# EasyEDA schematic 2_3_4.json
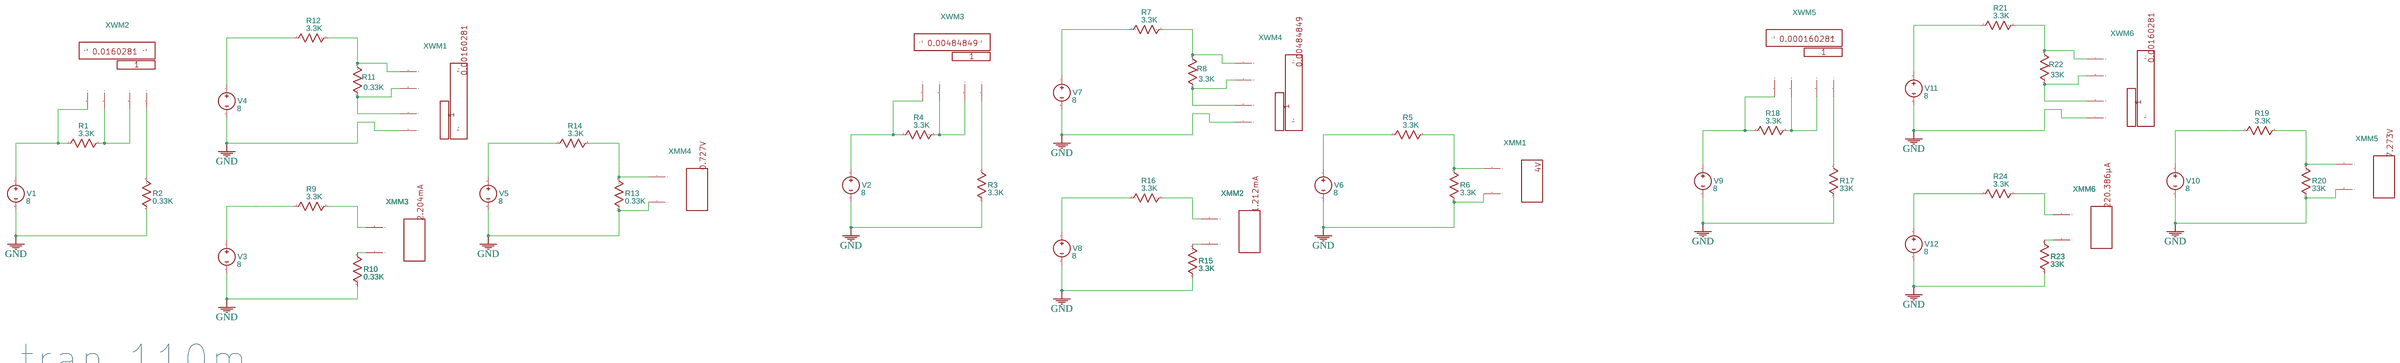
[diagram p0: schematic sheet]

## Parts
R1  3.3K  [AXIAL-0.3]
R2  0.33K  [AXIAL-0.3]
R3  3.3K  [AXIAL-0.3]
R4  3.3K  [AXIAL-0.3]
R5  3.3K  [AXIAL-0.3]
R6  3.3K  [AXIAL-0.3]
R7  3.3K  [AXIAL-0.3]
R8  3.3K  [AXIAL-0.3]
R9  3.3K  [AXIAL-0.3]
R10  0.33K  [AXIAL-0.3]
R11  0.33K  [AXIAL-0.3]
R12  3.3K  [AXIAL-0.3]
R13  0.33K  [AXIAL-0.3]
R14  3.3K  [AXIAL-0.3]
R15  3.3K  [AXIAL-0.3]
R16  3.3K  [AXIAL-0.3]
R17  33K  [AXIAL-0.3]
R18  3.3K  [AXIAL-0.3]
R19  3.3K  [AXIAL-0.3]
R20  33K  [AXIAL-0.3]
R21  3.3K  [AXIAL-0.3]
R22  33K  [AXIAL-0.3]
R23  33K  [AXIAL-0.3]
R24  3.3K  [AXIAL-0.3]
V1  8  [HDR1X2]
V2  8  [HDR1X2]
V3  8  [HDR1X2]
V4  8  [HDR1X2]
V5  8  [HDR1X2]
V6  8  [HDR1X2]
V7  8  [HDR1X2]
V8  8  [HDR1X2]
V9  8  [HDR1X2]
V10  8  [HDR1X2]
V11  8  [HDR1X2]
V12  8  [HDR1X2]
XMM1  Multimeter
XMM2  Multimeter
XMM3  Multimeter
XMM4  Multimeter
XMM5  Multimeter
XMM6  Multimeter
XWM1  Wattmeter
XWM2  Wattmeter
XWM3  Wattmeter
XWM4  Wattmeter
XWM5  Wattmeter
XWM6  Wattmeter

## Library data of the parts
R1-R24 = Resistor_US: Resistance: 1k; Contributor: EasyEDA; Supplier: YUJING
V1-V12 = VDC: Contributor: EasyEDA; sim: true
XMM1 XMM4 XMM5 = MULTIMETER: Supplier: LCSC; Multimeter Type: Voltmeter; Power Type: AC; Voltmeter resistance: 10μ; Ammeter resistance: 1G; NameDisplay: 0; Contributor: EasyEDA; sim: true
XMM2 XMM3 XMM6 = MULTIMETER: Supplier: LCSC; Multimeter Type: Amper; Power Type: AC; Voltmeter resistance: 10μ; Ammeter resistance: 1G; NameDisplay: 0; Contributor: EasyEDA; sim: true
XWM1-XWM6 = WATTMETER: Contributor: EasyEDA; NameDisplay: 0; sim: true

## Nets
GND: R2.1 R3.1 R6.1 R10.1 R13.1 R15.1 R17.1 R20.1 R23.1 V1.2 V2.2 V3.2 V4.2 V5.2 V6.2 V7.2 V8.2 V9.2 V10.2 V11.2 V12.2 XMM1.2(I) XMM4.2(I) XMM5.2(I) XWM1.4(I-) XWM4.4(I-) XWM6.4(I-)
Net-(R1-1): R1.1 V1.1 XWM2.1(V+)
Net-(R1-2): R1.2 XWM2.2(V-) XWM2.3(I+)
Net-(R2-2): R2.2 XWM2.4(I-)
Net-(R3-2): R3.2 XWM3.4(I-)
Net-(R4-1): R4.1 V2.1 XWM3.1(V+)
Net-(R4-2): R4.2 XWM3.2(V-) XWM3.3(I+)
Net-(R5-1): R5.1 V6.1
Net-(R5-2): R5.2 R6.2 XMM1.1(+)
Net-(R7-1): R7.1 V7.1
Net-(R7-2): R7.2 R8.2 XWM4.1(V+)
Net-(R8-1): R8.1 XWM4.2(V-) XWM4.3(I+)
Net-(R9-1): R9.1 V3.1
Net-(R9-2): R9.2 XMM3.1(+)
Net-(R10-2): R10.2 XMM3.2(I)
Net-(R11-1): R11.1 XWM1.2(V-) XWM1.3(I+)
Net-(R11-2): R11.2 R12.2 XWM1.1(V+)
Net-(R12-1): R12.1 V4.1
Net-(R13-2): R13.2 R14.2 XMM4.1(+)
Net-(R14-1): R14.1 V5.1
Net-(R15-2): R15.2 XMM2.2(I)
Net-(R16-1): R16.1 V8.1
Net-(R16-2): R16.2 XMM2.1(+)
Net-(R17-2): R17.2 XWM5.4(I-)
Net-(R18-1): R18.1 V9.1 XWM5.1(V+)
Net-(R18-2): R18.2 XWM5.2(V-) XWM5.3(I+)
Net-(R19-1): R19.1 V10.1
Net-(R19-2): R19.2 R20.2 XMM5.1(+)
Net-(R21-1): R21.1 V11.1
Net-(R21-2): R21.2 R22.2 XWM6.1(V+)
Net-(R22-1): R22.1 XWM6.2(V-) XWM6.3(I+)
Net-(R23-2): R23.2 XMM6.2(I)
Net-(R24-1): R24.1 V12.1
Net-(R24-2): R24.2 XMM6.1(+)

Not connected (* = marked no-connect by the designer): XWM1 P PF; XWM2 P PF; XWM3 P PF; XWM4 P PF; XWM5 P PF; XWM6 P PF

## Notes on the sheet
- .tran 110m
